# EAGLE schematic teensyMotors02_up_LED_SX (EAGLE 9.1.3)

## Sheet 1 of 2
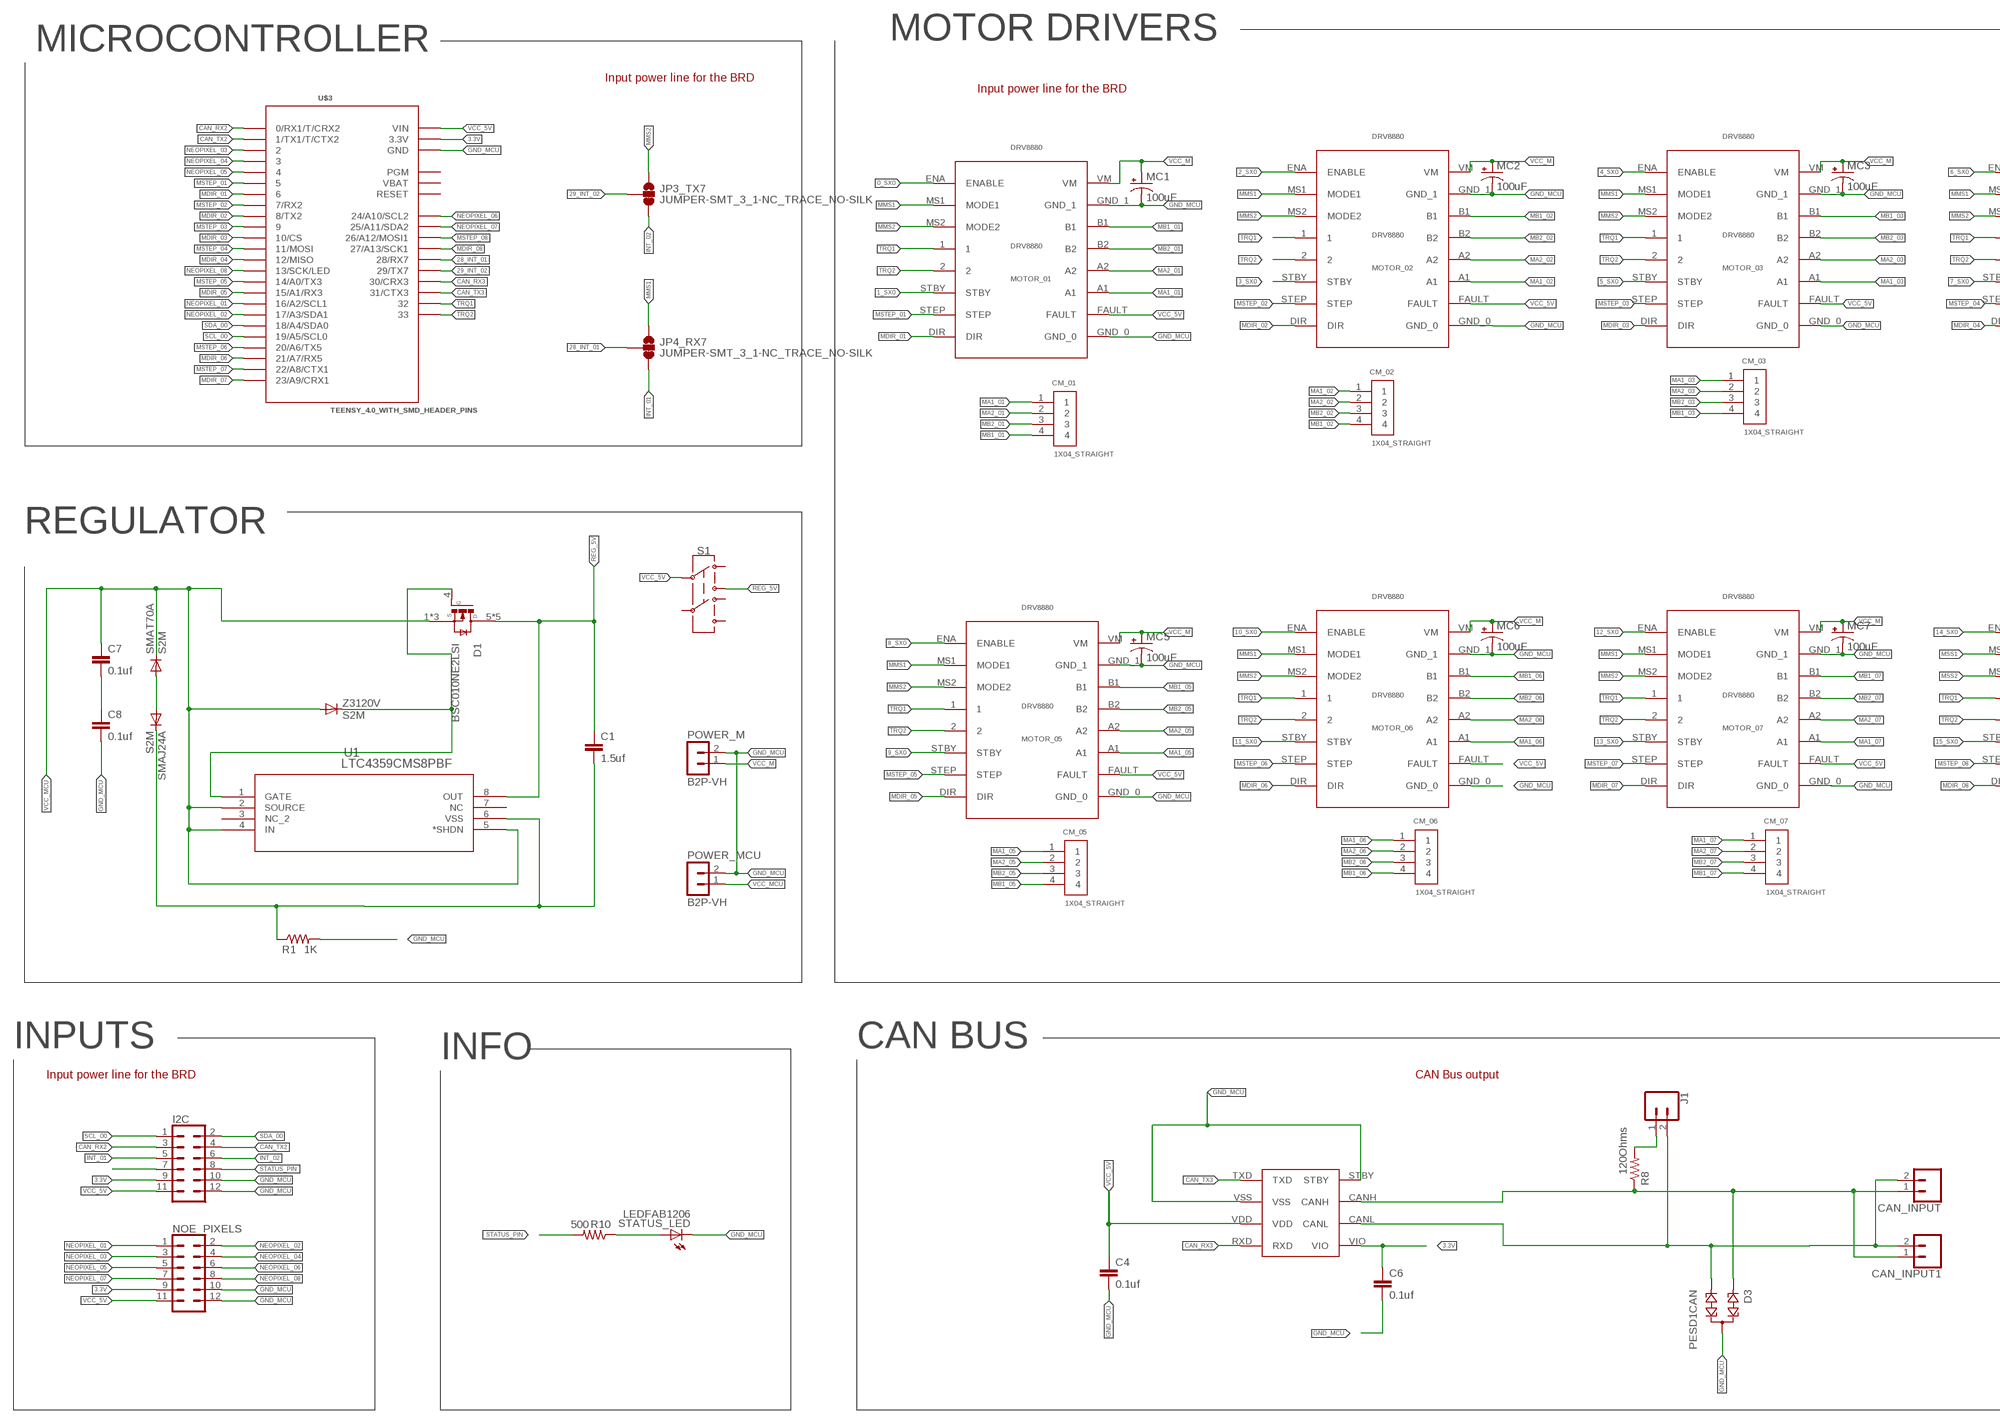
[diagram p0: schematic, sheet 1, part 1 of 2]
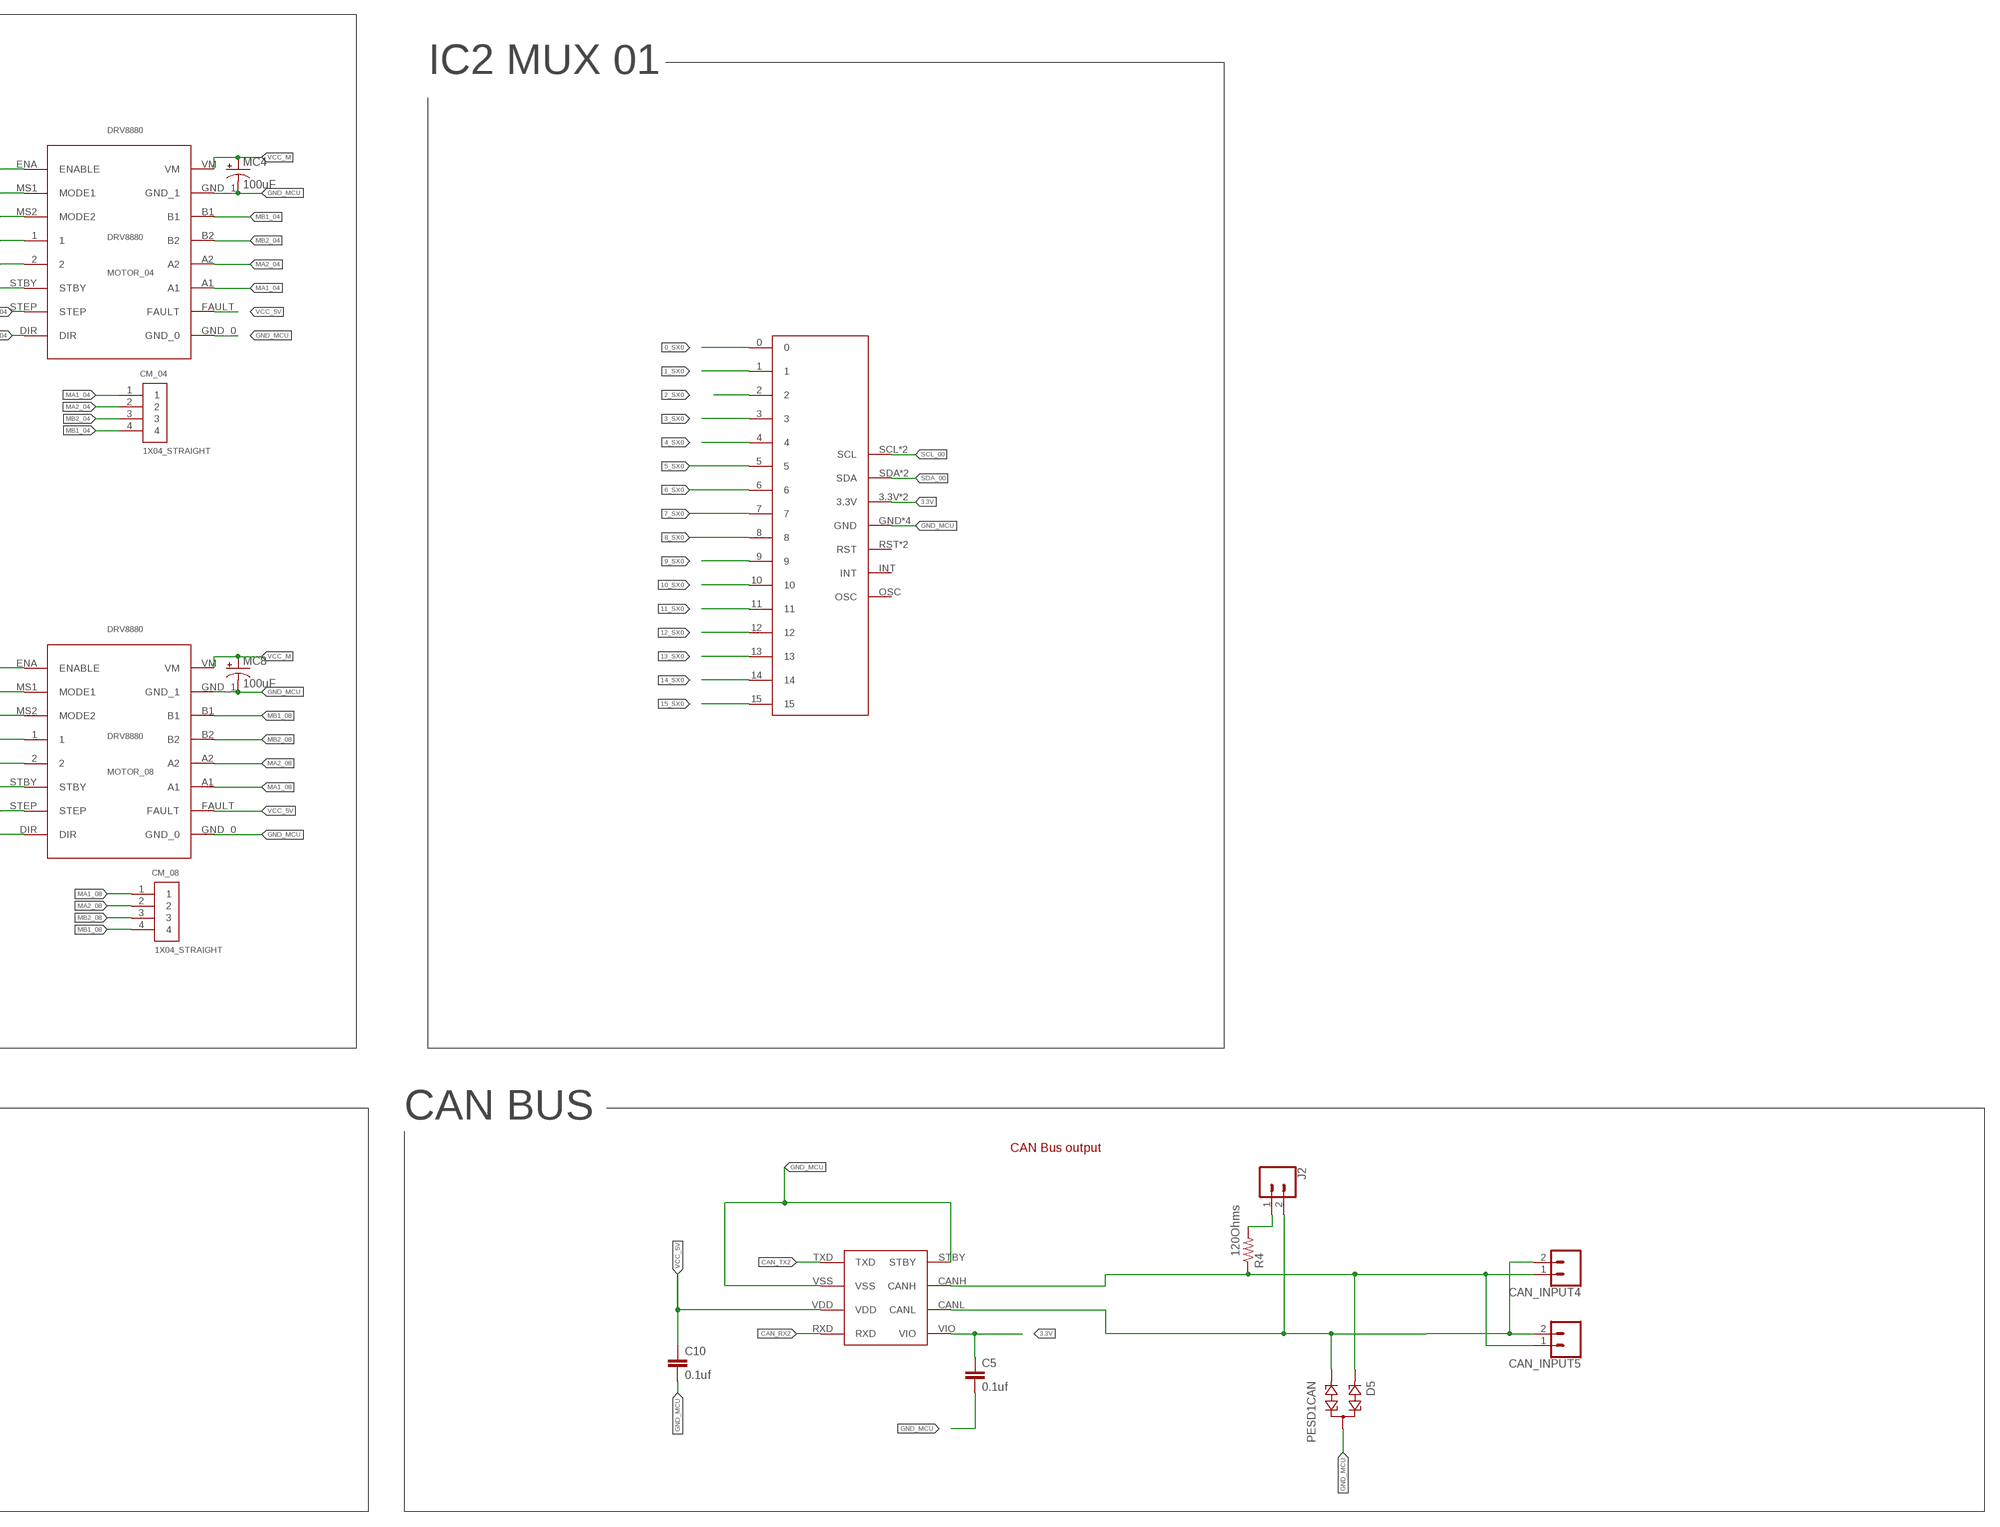
[diagram p1: schematic, sheet 1, part 2 of 2]

### Parts
C1  1.5uf  0.1UF-25V(+80/-20%)(0603)  [0603-CAP]
C4  0.1uf  0.1UF-25V(+80/-20%)(0603)  [0603-CAP]
C5  0.1uf  0.1UF-25V(+80/-20%)(0603)  [0603-CAP]
C6  0.1uf  0.1UF-25V(+80/-20%)(0603)  [0603-CAP]
C7  0.1uf  0.1UF-25V(+80/-20%)(0603)  [0603-CAP]
C8  0.1uf  0.1UF-25V(+80/-20%)(0603)  [0603-CAP]
C10  0.1uf  0.1UF-25V(+80/-20%)(0603)  [0603-CAP]
CAN_INPUT  CONN_02-JST-2MM-SMT  [JST-2-SMD]
CAN_INPUT1  CONN_02-JST-2MM-SMT  [JST-2-SMD]
CAN_INPUT4  CONN_02-JST-2MM-SMT  [JST-2-SMD]
CAN_INPUT5  CONN_02-JST-2MM-SMT  [JST-2-SMD]
CM_01  1X04_STRAIGHT  1X4-CLEANBIG  [1X04-CLEANBIG]
CM_02  1X04_STRAIGHT  1X4-CLEANBIG  [1X04-CLEANBIG]
CM_03  1X04_STRAIGHT  1X4-CLEANBIG  [1X04-CLEANBIG]
CM_04  1X04_STRAIGHT  1X4-CLEANBIG  [1X04-CLEANBIG]
CM_05  1X04_STRAIGHT  1X4-CLEANBIG  [1X04-CLEANBIG]
CM_06  1X04_STRAIGHT  1X4-CLEANBIG  [1X04-CLEANBIG]
CM_07  1X04_STRAIGHT  1X4-CLEANBIG  [1X04-CLEANBIG]
CM_08  1X04_STRAIGHT  1X4-CLEANBIG  [1X04-CLEANBIG]
D1  BSC010NE2LSI  [SOFL127P515X615X110-9N]
D3  PESD1CAN  [SOT23]
D5  PESD1CAN  [SOT23]
I2C  CONN_06X2SMD_FEMALE  [2X6_SMD]
J1  CONN_02  [1X02]
J2  CONN_02  [1X02]
JP3_TX7  JUMPER-SMT_3_1-NC_TRACE_NO-SILK  [SMT-JUMPER_3_1-NC_TRACE_NO-SILK]
JP4_RX7  JUMPER-SMT_3_1-NC_TRACE_NO-SILK  [SMT-JUMPER_3_1-NC_TRACE_NO-SILK]
MC1  100uF  100UF-POLAR-25V-20%(ELEC)  [PANASONIC_D]
MC2  100uF  100UF-POLAR-25V-20%(ELEC)  [PANASONIC_D]
MC3  100uF  100UF-POLAR-25V-20%(ELEC)  [PANASONIC_D]
MC4  100uF  100UF-POLAR-25V-20%(ELEC)  [PANASONIC_D]
MC5  100uF  100UF-POLAR-25V-20%(ELEC)  [PANASONIC_D]
MC6  100uF  100UF-POLAR-25V-20%(ELEC)  [PANASONIC_D]
MC7  100uF  100UF-POLAR-25V-20%(ELEC)  [PANASONIC_D]
MC8  100uF  100UF-POLAR-25V-20%(ELEC)  [PANASONIC_D]
MOTOR_01  DRV8880  [DRV8880]
MOTOR_02  DRV8880  [DRV8880]
MOTOR_03  DRV8880  [DRV8880]
MOTOR_04  DRV8880  [DRV8880]
MOTOR_05  DRV8880  [DRV8880]
MOTOR_06  DRV8880  [DRV8880]
MOTOR_07  DRV8880  [DRV8880]
MOTOR_08  DRV8880  [DRV8880]
NOE_PIXELS  CONN_06X2SMD_FEMALE  [2X6_SMD]
POWER_M  B2P-VH  [B2P-VH]
POWER_MCU  B2P-VH  [B2P-VH]
R1  1K  10KOHM-1/10W-1%(0603)0603  [0603-RES]
R4  120Ohms  10KOHM-1/10W-1%(0603)0603  [0603-RES]
R8  120Ohms  10KOHM-1/10W-1%(0603)0603  [0603-RES]
R10  500  10KOHM-1/10W-1%(0603)0603  [0603-RES]
S1  SWITCH-DPDT-SMD-AYZ0202  [SWITCH_DPDT_SMD_AYZ0202]
SMAJ24A  S2M  [DO214AA]
SMAT70A  S2M  [DO214AA]
STATUS_LED  LEDFAB1206  [LED1206FAB]
U1  LTC4359CMS8PBF  [MSOP-8_MS]
U$1  MCP2562  [MCP2562]
U$3  TEENSY_4.0_WITH_SMD_HEADER_PINS  [TEENSY_4.0_WITH_SMD_HEADER_PINS]
U$5  SX1509  [SX1509]
U$6  MCP2562  [MCP2562]
Z3120V  S2M  [DO214AA]

### Nets
0_SX0: MOTOR_01.ENA(ENABLE) U$5.0
1_SX0: MOTOR_01.STBY U$5.1
2_SX0: MOTOR_02.ENA(ENABLE) U$5.2
3.3V [vcc]: C5.1 C6.1 I2C.9 NOE_PIXELS.9 U$1.VIO U$3.3.3V U$3.3.3V1(3.3V) U$5.3.3V U$5.3.3V_1(3.3V) U$6.VIO
3_SX0: MOTOR_02.STBY U$5.3
4_SX0: MOTOR_03.ENA(ENABLE) U$5.4
5_SX0: MOTOR_03.STBY U$5.5
6_SX0: MOTOR_04.ENA(ENABLE) U$5.6
7_SX0: MOTOR_04.STBY U$5.7
8_SX0: MOTOR_05.ENA(ENABLE) U$5.8
9_SX0: MOTOR_05.STBY U$5.9
10_SX0: MOTOR_06.ENA(ENABLE) U$5.10
11_SX0: MOTOR_06.STBY U$5.11
12_SX0: MOTOR_07.ENA(ENABLE) U$5.12
13_SX0: MOTOR_07.STBY U$5.13
14_SX0: MOTOR_08.ENA(ENABLE) U$5.14
15_SX0: MOTOR_08.STBY U$5.15
28_INT_01: JP4_RX7.2 U$3.28(28/RX7)
29_INT_02: JP3_TX7.2 U$3.29(29/TX7)
CAN_H: CAN_INPUT1.1 CAN_INPUT.1 D3.1 R8.1 U$1.CANH
CAN_H2: CAN_INPUT4.1 CAN_INPUT5.1 D5.1 R4.1 U$6.CANH
CAN_L: CAN_INPUT1.2 CAN_INPUT.2 D3.2 J1.2 U$1.CANL
CAN_L2: CAN_INPUT4.2 CAN_INPUT5.2 D5.2 J2.2 U$6.CANL
CAN_RX2: I2C.3 U$3.0(0/RX1/T/CRX2) U$6.RXD
CAN_RX3: U$1.RXD U$3.30(30/CRX3)
CAN_TX2: I2C.4 U$3.1(1/TX1/T/CTX2) U$6.TXD
CAN_TX3: U$1.TXD U$3.31(31/CTX3)
GND_MCU [gnd]: C4.2 C5.2 C6.2 C8.2 C10.2 D3.3 D5.3 I2C.10 I2C.12 MC1.- MC2.- MC3.- MC4.- MC5.- MC6.- MC7.- MC8.- MOTOR_01.GND_0 MOTOR_01.GND_1 MOTOR_02.GND_0 MOTOR_02.GND_1 MOTOR_03.GND_0 MOTOR_03.GND_1 MOTOR_04.GND_0 MOTOR_04.GND_1 MOTOR_05.GND_0 MOTOR_05.GND_1 MOTOR_06.GND_0 MOTOR_06.GND_1 MOTOR_07.GND_0 MOTOR_07.GND_1 MOTOR_08.GND_0 MOTOR_08.GND_1 NOE_PIXELS.10 NOE_PIXELS.12 POWER_M.2 POWER_MCU.2 R1.2 STATUS_LED.2(C) U$1.STBY U$1.VSS U$3.GND U$3.GND1(GND) U$3.GND2(GND) U$5.GND U$5.GND_1(GND) U$5.GND_2(GND) U$5.GND_3(GND) U$6.STBY U$6.VSS
INT_01: I2C.5 JP4_RX7.3
INT_02: I2C.6 JP3_TX7.3
MA1_01 [vcc]: CM_01.1 MOTOR_01.A1
MA1_02 [vcc]: CM_02.1 MOTOR_02.A1
MA1_03 [vcc]: CM_03.1 MOTOR_03.A1
MA1_04 [vcc]: CM_04.1 MOTOR_04.A1
MA1_05 [vcc]: CM_05.1 MOTOR_05.A1
MA1_06 [vcc]: CM_06.1 MOTOR_06.A1
MA1_07 [vcc]: CM_07.1 MOTOR_07.A1
MA1_08 [vcc]: CM_08.1 MOTOR_08.A1
MA2_01 [vcc]: CM_01.2 MOTOR_01.A2
MA2_02 [vcc]: CM_02.2 MOTOR_02.A2
MA2_03 [vcc]: CM_03.2 MOTOR_03.A2
MA2_04 [vcc]: CM_04.2 MOTOR_04.A2
MA2_05 [vcc]: CM_05.2 MOTOR_05.A2
MA2_06 [vcc]: CM_06.2 MOTOR_06.A2
MA2_07 [vcc]: CM_07.2 MOTOR_07.A2
MA2_08 [vcc]: CM_08.2 MOTOR_08.A2
MB1_01 [vcc]: CM_01.4 MOTOR_01.B1
MB1_02 [vcc]: CM_02.4 MOTOR_02.B1
MB1_03 [vcc]: CM_03.4 MOTOR_03.B1
MB1_04 [vcc]: CM_04.4 MOTOR_04.B1
MB1_05 [vcc]: CM_05.4 MOTOR_05.B1
MB1_06 [vcc]: CM_06.4 MOTOR_06.B1
MB1_07 [vcc]: CM_07.4 MOTOR_07.B1
MB1_08 [vcc]: CM_08.4 MOTOR_08.B1
MB2_01 [vcc]: CM_01.3 MOTOR_01.B2
MB2_02 [vcc]: CM_02.3 MOTOR_02.B2
MB2_03 [vcc]: CM_03.3 MOTOR_03.B2
MB2_04 [vcc]: CM_04.3 MOTOR_04.B2
MB2_05 [vcc]: CM_05.3 MOTOR_05.B2
MB2_06 [vcc]: CM_06.3 MOTOR_06.B2
MB2_07 [vcc]: CM_07.3 MOTOR_07.B2
MB2_08 [vcc]: CM_08.3 MOTOR_08.B2
MDIR_01: MOTOR_01.DIR U$3.6
MDIR_02: MOTOR_02.DIR U$3.8(8/TX2)
MDIR_03: MOTOR_03.DIR U$3.10(10/CS)
MDIR_04: MOTOR_04.DIR U$3.12(12/MISO)
MDIR_05: MOTOR_05.DIR U$3.15/A1(15/A1/RX3)
MDIR_06: MOTOR_06.DIR U$3.21/A7(21/A7/RX5)
MDIR_07: MOTOR_07.DIR U$3.23/A9(23/A9/CRX1)
MDIR_08: MOTOR_08.DIR U$3.27(27/A13/SCK1)
MMS1: JP4_RX7.1 MOTOR_01.MS1(MODE1) MOTOR_02.MS1(MODE1) MOTOR_03.MS1(MODE1) MOTOR_04.MS1(MODE1) MOTOR_05.MS1(MODE1) MOTOR_06.MS1(MODE1) MOTOR_07.MS1(MODE1)
MMS2: JP3_TX7.1 MOTOR_01.MS2(MODE2) MOTOR_02.MS2(MODE2) MOTOR_03.MS2(MODE2) MOTOR_04.MS2(MODE2) MOTOR_05.MS2(MODE2) MOTOR_06.MS2(MODE2) MOTOR_07.MS2(MODE2)
MSS1: MOTOR_08.MS1(MODE1)
MSS2: MOTOR_08.MS2(MODE2)
MSTEP_01: MOTOR_01.STEP U$3.5
MSTEP_02: MOTOR_02.STEP U$3.7(7/RX2)
MSTEP_03: MOTOR_03.STEP U$3.9
MSTEP_04: MOTOR_04.STEP U$3.11(11/MOSI)
MSTEP_05: MOTOR_05.STEP U$3.14/A0(14/A0/TX3)
MSTEP_06: MOTOR_06.STEP U$3.20/A6(20/A6/TX5)
MSTEP_07: MOTOR_07.STEP U$3.22/A8(22/A8/CTX1)
MSTEP_08: MOTOR_08.STEP U$3.26(26/A12/MOSI1)
N$1: J1.1 R8.2
N$2: D1.4(G) U1.1(GATE) Z3120V.C
N$3: J2.1 R4.2
N$4: C1.2 R1.1 SMAJ24A.C U1.6(VSS)
N$9: C7.2 C8.1
N$12: SMAJ24A.A SMAT70A.A
N$193: R10.1 STATUS_LED.1(A)
NEOPIXEL_01: NOE_PIXELS.1 U$3.16/A2(16/A2/SCL1)
NEOPIXEL_02: NOE_PIXELS.2 U$3.17/A3(17/A3/SDA1)
NEOPIXEL_03: NOE_PIXELS.3 U$3.2
NEOPIXEL_04: NOE_PIXELS.4 U$3.3
NEOPIXEL_05: NOE_PIXELS.5 U$3.4
NEOPIXEL_06: NOE_PIXELS.6 U$3.24(24/A10/SCL2)
NEOPIXEL_07: NOE_PIXELS.7 U$3.25(25/A11/SDA2)
NEOPIXEL_08: NOE_PIXELS.8 U$3.13(13/SCK/LED)
PIN_EX: I2C.7
REG_5V [vcc5]: C1.1 D1.5(D) D1.6(D) D1.7(D) D1.8(D) D1.9(D) S1.3 U1.8(OUT)
SCL_00: I2C.1 U$3.19/A5(19/A5/SCL0) U$5.SCL U$5.SCL_2(SCL)
SDA_00: I2C.2 U$3.18/A4(18/A4/SDA0) U$5.SDA U$5.SDA_2(SDA)
STATUS_PIN: I2C.8 R10.2
TRQ1: MOTOR_01.1 MOTOR_02.1 MOTOR_03.1 MOTOR_04.1 MOTOR_05.1 MOTOR_06.1 MOTOR_07.1 MOTOR_08.1 U$3.32
TRQ2: MOTOR_01.2 MOTOR_02.2 MOTOR_03.2 MOTOR_04.2 MOTOR_05.2 MOTOR_06.2 MOTOR_07.2 MOTOR_08.2 U$3.33
VCC_5V [vcc5]: C4.1 C10.1 I2C.11 MOTOR_01.FAULT MOTOR_02.FAULT MOTOR_03.FAULT MOTOR_04.FAULT MOTOR_05.FAULT MOTOR_06.FAULT MOTOR_07.FAULT MOTOR_08.FAULT NOE_PIXELS.11 S1.2 U$1.VDD U$3.VIN U$6.VDD
VCC_M [vcc]: MC1.+ MC2.+ MC3.+ MC4.+ MC5.+ MC6.+ MC7.+ MC8.+ MOTOR_01.VM MOTOR_02.VM MOTOR_03.VM MOTOR_04.VM MOTOR_05.VM MOTOR_06.VM MOTOR_07.VM MOTOR_08.VM POWER_M.1
VCC_MCU [vcc]: C7.1 D1.1(S) D1.2(S) D1.3(S) POWER_MCU.1 SMAT70A.C U1.2(SOURCE) U1.4(IN) U1.5(*SHDN) Z3120V.A
Unconnected: S1.1 S1.4 S1.5 S1.6 U1.3(NC_2) U1.7(NC) U$3.PGM U$3.RESET U$5.INT U$5.OSC U$5.RST U$5.RST_1(RST)

### Notes on the sheet
- MICROCONTROLLER | MOTOR DRIVERS
- Input power line for the BRD
- Input power line for the BRD | IC2 MUX 01
- REGULATOR
- INPUTS | INFO | CAN BUS | CAN BUS
- Input power line for the BRD | CAN Bus output | CAN Bus output

## Sheet 2 of 2

## Power pins joined to a net without a drawn wire
VBAT: U$3.VBAT

## Library data of the parts
C1 C4-C8 C10 = SparkFun-Capacitors:0.1UF-25V(+80/-20%)(0603): CAP-00810 Ceramic Standard decoupling cap; PROD_ID: CAP-00810; VALUE: 0.1uF
CAN_INPUT CAN_INPUT1 CAN_INPUT4 CAN_INPUT5 = SparkFun-Connectors:CONN_02: Multi connection point. Often used as Generic Header-pin footprint for 0.1 inch spaced/style header connections On any of the 0.1 inch spaced packages, you can populate with these: Break Away Headers - Straight <https://www.sparkfun.com/products/116> (PRT-00116) Break Away Male Headers - Right Angle <https://www.sparkfun.com/products/553> (PRT-00553) Female Headers <https://www.sparkfun.com/products/115> (PRT-00115) Break Away Headers - Machine Pin <https://www.sparkfun.com/products/117> (PRT-00117) Break Away Female Headers - Swiss Machine Pin <https://www.sparkfun.com/products/743> (PRT-00743) For SCREWTERMINALS and SPRING TERMINALS visit here: Screw Terimnals on SparkFun.com <https://www.sparkfun.com/search/results?term=Screw+Terminals> (5mm/3.5mm/2.54mm spacing) This device is also useful as a general connection point to wire up your design to another part of your project. Our various solder wires solder well into these plated through hole pads. Hook-Up Wire - Assortment (Stranded, 22 AWG) <https://www.sparkfun.com/products/11375> (PRT-11375) Hook-Up Wire - Assortment (Solid Core, 22 AWG) <https://www.sparkfun.com/products/11367> (PRT-11367) View the entire wire category on our website here <https://www.sparkfun.com/categories/141> Special notes: Molex polarized connector foot print use with: PRT-08233 with associated crimp pins and housings. 2.54_SCREWTERM for use with PRT-10571. 3.5mm Screw Terminal footprints for PRT-08084 5mm Screw Terminal footprints for use with PRT-08432; PROD_ID: CONN-11443
CM_01-CM_08 = adafruit:1X4: 4-pin connector
D1 = BSC010NE2LSI:BSC010NE2LSI: Transistor: N-MOSFET; unipolar; 25V; 38A; 96W; PG-TDSON-8; OptiMOS™; DESCRIPTION: N-Channel 25V 38A _Ta_, 100A _Tc_ 2.5W _Ta_, 96W _Tc_ Surface Mount PG-TDSON-8-7; DIGI-KEY_PART_NUMBER: BSC010NE2LSIATMA1CT-ND; DIGI-KEY_PURCHASE_URL: https://www.digikey.com/product-detail/en/infineon-technologies/BSC010NE2LSIATMA1/BSC010NE2LSIATMA1CT-ND/3196614?utm_source=snapeda&utm_medium=aggregator&utm_campaign=symbol; MF: Infineon; MP: BSC010NE2LSI; PACKAGE: PG-TDSON-8 Infineon
D3 D5 = diode:PESD1CAN: CAN bus ESD protection diode Source: http://www.nxp.com/documents/data_sheet/PESD1CAN.pdf
I2C NOE_PIXELS = SparkFun-Connectors:CONN_06X2: Multi connection point. Often used as Generic Header-pin footprint for 0.1 inch spaced/style header connections On any of the 0.1 inch spaced packages, you can populate with these: Break Away Headers - Straight <https://www.sparkfun.com/products/116> (PRT-00116) Break Away Male Headers - Right Angle <https://www.sparkfun.com/products/553> (PRT-00553) Female Headers <https://www.sparkfun.com/products/115> (PRT-00115) Break Away Headers - Machine Pin <https://www.sparkfun.com/products/117> (PRT-00117) Break Away Female Headers - Swiss Machine Pin <https://www.sparkfun.com/products/743> (PRT-00743)
J1 J2 = SparkFun-Connectors:CONN_02: Multi connection point. Often used as Generic Header-pin footprint for 0.1 inch spaced/style header connections On any of the 0.1 inch spaced packages, you can populate with these: Break Away Headers - Straight <https://www.sparkfun.com/products/116> (PRT-00116) Break Away Male Headers - Right Angle <https://www.sparkfun.com/products/553> (PRT-00553) Female Headers <https://www.sparkfun.com/products/115> (PRT-00115) Break Away Headers - Machine Pin <https://www.sparkfun.com/products/117> (PRT-00117) Break Away Female Headers - Swiss Machine Pin <https://www.sparkfun.com/products/743> (PRT-00743) For SCREWTERMINALS and SPRING TERMINALS visit here: Screw Terimnals on SparkFun.com <https://www.sparkfun.com/search/results?term=Screw+Terminals> (5mm/3.5mm/2.54mm spacing) This device is also useful as a general connection point to wire up your design to another part of your project. Our various solder wires solder well into these plated through hole pads. Hook-Up Wire - Assortment (Stranded, 22 AWG) <https://www.sparkfun.com/products/11375> (PRT-11375) Hook-Up Wire - Assortment (Solid Core, 22 AWG) <https://www.sparkfun.com/products/11367> (PRT-11367) View the entire wire category on our website here <https://www.sparkfun.com/categories/141> Special notes: Molex polarized connector foot print use with: PRT-08233 with associated crimp pins and housings. 2.54_SCREWTERM for use with PRT-10571. 3.5mm Screw Terminal footprints for PRT-08084 5mm Screw Terminal footprints for use with PRT-08432
JP3_TX7 JP4_RX7 = SparkFun-Jumpers:JUMPER-SMT_3_1-NC_TRACE: Normally closed trace jumper (1 of 2 connections) This jumper has a trace between two pads so it's normally closed (NC). The other connection is normally open (NO). Use a razor knife to open the connection. For best results follow the IPC guidelines for cutting traces: Cutout at least 0.063 mm (0.005 in). Remove all loose material to clean up the cut area. Seal the cut with an approved epoxy. Reapply solder to reclose the connection, or to close the NO connection.
MC1-MC8 = SparkFun-Capacitors:100UF-POLAR: 100µF polarized capacitors A capacitor is a passive two-terminal electrical component used to store electrical energy temporarily in an electric field.; PROD_ID: CAP-12547
MOTOR_01-MOTOR_08 = STSPIN220:DRV8880
POWER_M POWER_MCU = con-JST VH:B2P-VH: JST VH Series header 3.96mm pitch disconnectable crimp style connectors, vertical (side entry type), 2 pins
R1 R4 R8 R10 = SparkFun-Resistors:10KOHM-1/10W-1%(0603): RES-00824; PROD_ID: RES-00824; VALUE: 10K
S1 = SparkFun-Switches:SWITCH-DPDT: Double-Pole, Double-Throw (DPDT) Switch Double-pole, double-throw switches. Variant Overview PTH-GPI-152-3013 Used on SparkFun Geiger Counter <https://www.sparkfun.com/products/11345> SMD-AY0202 Surface Mount DPDT Switch <https://www.sparkfun.com/products/597> (COM-00597) Used on e.g. LilyPad Arduino USB - ATmega32U4 Board <https://www.sparkfun.com/products/12049>; PROD_ID: SWCH-08179; SF_SKU: COM-00597; SPICEPREFIX: X
SMAJ24A SMAT70A Z3120V = s2x_10:S2*: S2A - S2M General Purpose Rectifiers Source: http://www.fairchildsemi.com/datasheets/S2/S2A.pdf; MF: Fairchild; MPN: S2M; OC_FARNELL: 9843876; OC_NEWARK: 58K9553
STATUS_LED = fab:LED: LED
U1 = LTC4359CMS8PBF:LTC4359CMS8PBF; AVAILABILITY: Unavailable; DESCRIPTION: OR Controller N+1 ORing Controller N-Channel N:1 8-MSOP; MF: Linear Technology; MP: LTC4359CMS8#PBF; PACKAGE: MSOP-8 Linear Technology; PRICE: None
U$1 U$6 = MCP2562:MCP2562
U$3 = Teensy4:TEENSY_4.0_WITH_SMD_HEADER_PINS: Footprint for Teensy 3.1 or 3.2 board using all pin connections on the outer perimeter
U$5 = SX1509_s:SX1509

## Net classes
0 default: width 0.2 mm, clearance 0.2 mm
1 gnd: width 0.2 mm, clearance 0.2 mm
3 vcc: width 0.2 mm, clearance 0.2 mm
4 vcc5: width 0.35 mm, clearance 0.2 mm